# EAGLE design FrontPanel_v2 (EAGLE 9.7.0)
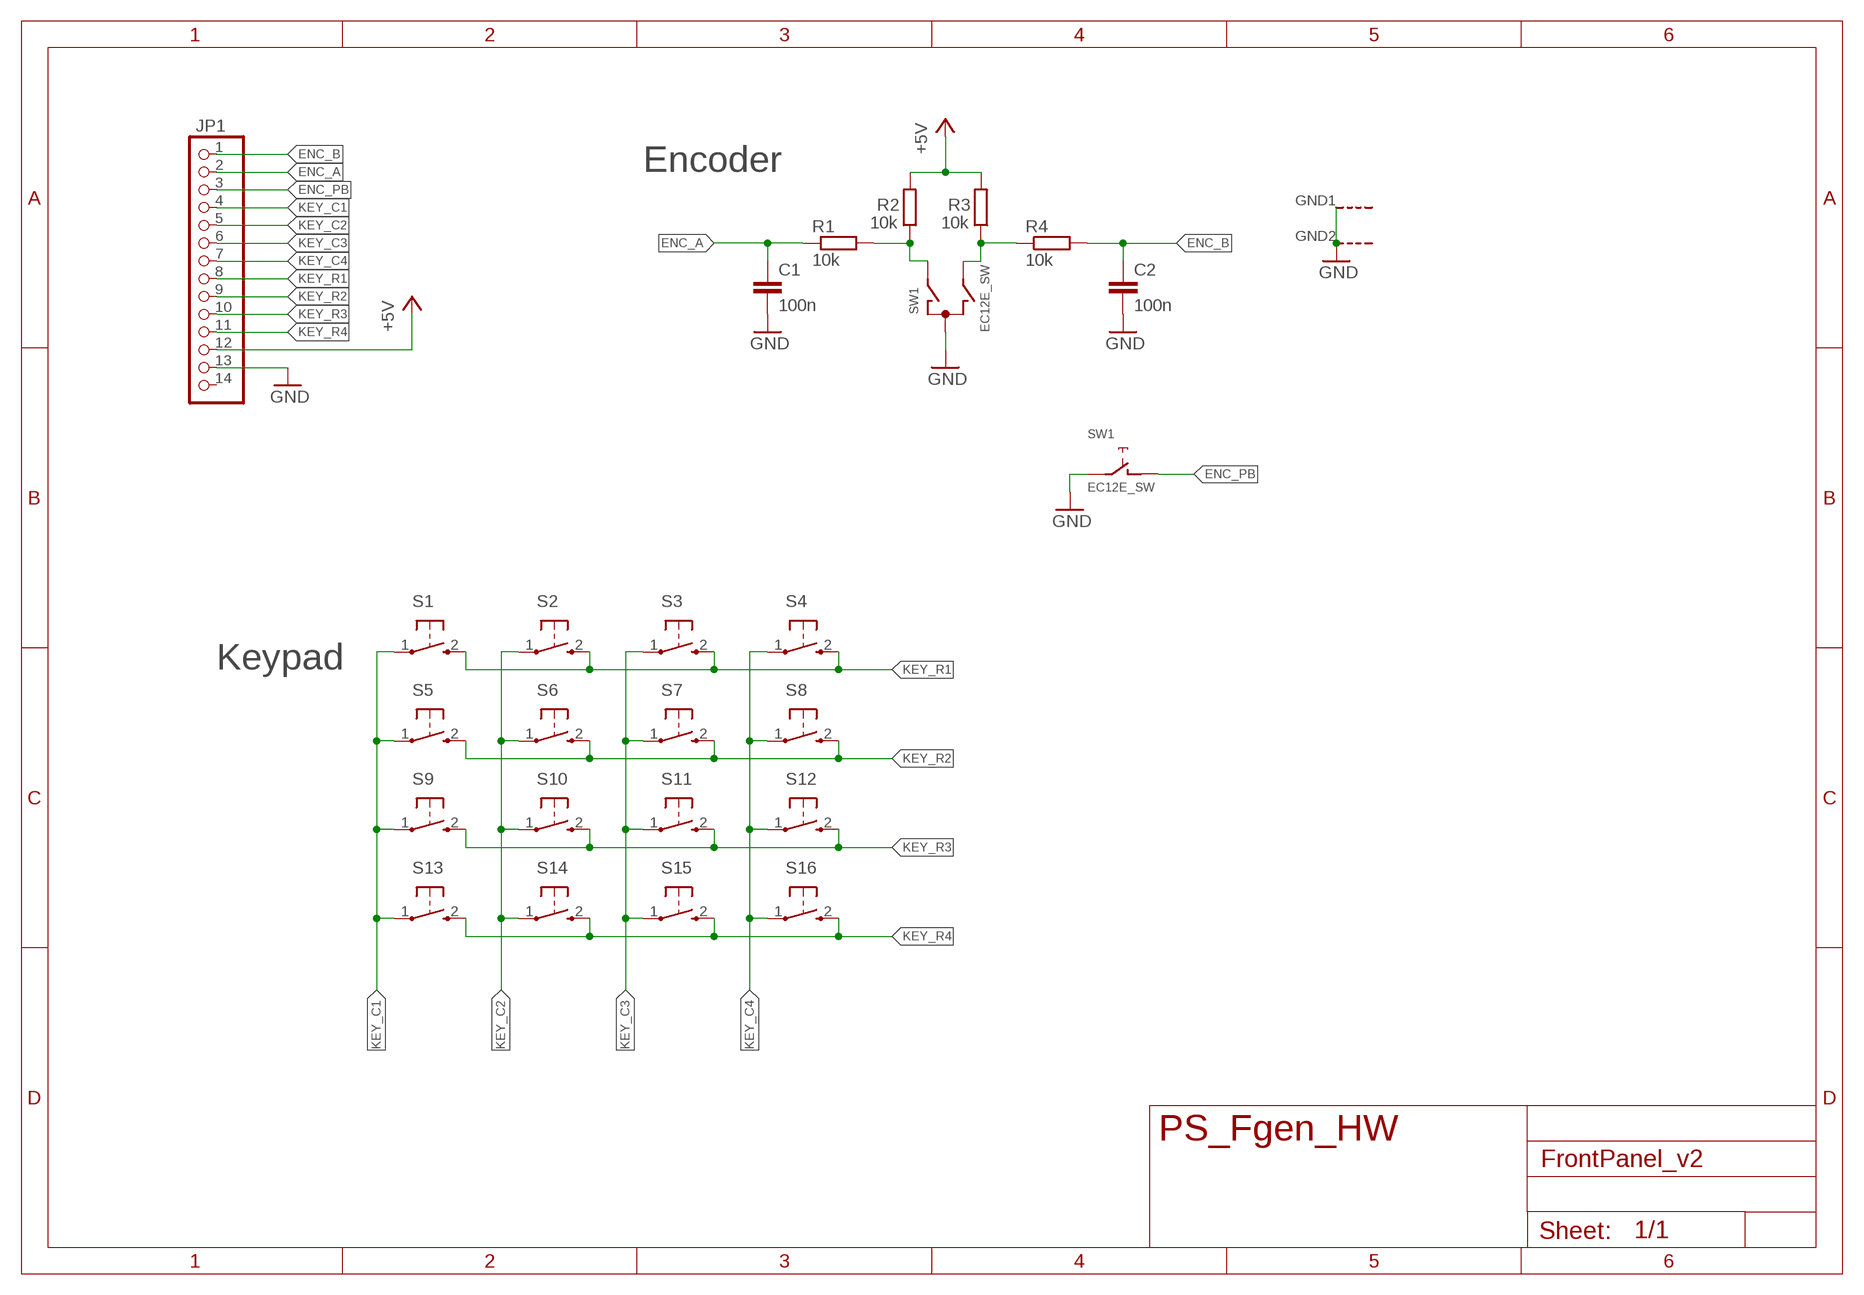
[diagram p0: schematic, sheet 1]

## Parts
C1  100n  C-EUC0805  [C0805]
C2  100n  C-EUC0805  [C0805]
JP1  PINHD-1X14  [1X14]
R1  10k  R-EU_R0805  [R0805]
R2  10k  R-EU_R0805  [R0805]
R3  10k  R-EU_R0805  [R0805]
R4  10k  R-EU_R0805  [R0805]
S1  KURZHUBTASTER  [B3F-10XX]
S2  KURZHUBTASTER  [B3F-10XX]
S3  KURZHUBTASTER  [B3F-10XX]
S4  KURZHUBTASTER  [B3F-10XX]
S5  KURZHUBTASTER  [B3F-10XX]
S6  KURZHUBTASTER  [B3F-10XX]
S7  KURZHUBTASTER  [B3F-10XX]
S8  KURZHUBTASTER  [B3F-10XX]
S9  KURZHUBTASTER  [B3F-10XX]
S10  KURZHUBTASTER  [B3F-10XX]
S11  KURZHUBTASTER  [B3F-10XX]
S12  KURZHUBTASTER  [B3F-10XX]
S13  KURZHUBTASTER  [B3F-10XX]
S14  KURZHUBTASTER  [B3F-10XX]
S15  KURZHUBTASTER  [B3F-10XX]
S16  KURZHUBTASTER  [B3F-10XX]
SW1  EC12E_SW  [ALPS_EC12E_SW]

## Nets
+5V: JP1.12 R2.2 R3.2
ENC_A: C1.1 JP1.2 R1.1
ENC_B: C2.1 JP1.1 R4.2
ENC_PB: JP1.3 SW1.D
GND: C1.2 C2.2 JP1.13 SW1.C SW1.E SW1.GND1(G) SW1.GND2(G)
KEY_C1: JP1.4 S1.1(P) S5.1(P) S9.1(P) S13.1(P)
KEY_C2: JP1.5 S2.1(P) S6.1(P) S10.1(P) S14.1(P)
KEY_C3: JP1.6 S3.1(P) S7.1(P) S11.1(P) S15.1(P)
KEY_C4: JP1.7 S4.1(P) S8.1(P) S12.1(P) S16.1(P)
KEY_R1: JP1.8 S1.2(S) S2.2(S) S3.2(S) S4.2(S)
KEY_R2: JP1.9 S5.2(S) S6.2(S) S7.2(S) S8.2(S)
KEY_R3: JP1.10 S9.2(S) S10.2(S) S11.2(S) S12.2(S)
KEY_R4: JP1.11 S13.2(S) S14.2(S) S15.2(S) S16.2(S)
N$1: R1.2 R2.1 SW1.A
N$2: R3.1 R4.1 SW1.B
Unconnected: JP1.14

## Notes on the sheet
- Encoder
- Keypad
- PS_Fgen_HW

## Library data of the parts
C1 C2 = rcl:C-EU: CAPACITOR, European symbol; SPICEPREFIX: C
JP1 = pinhead:PINHD-1X14: PIN HEADER
R1-R4 = rcl:R-EU_: RESISTOR, European symbol; SPICEPREFIX: R
S1-S16 = OwnDevices:KURZHUBTASTER: OMRON SWITCH
SW1 = switch-alps:EC12E_SW: ALPS rotary Encoder EC12E series with switch; MPN: EC12E2424407; OC_FARNELL: 1520813; OC_NEWARK: 74M1068

## Board
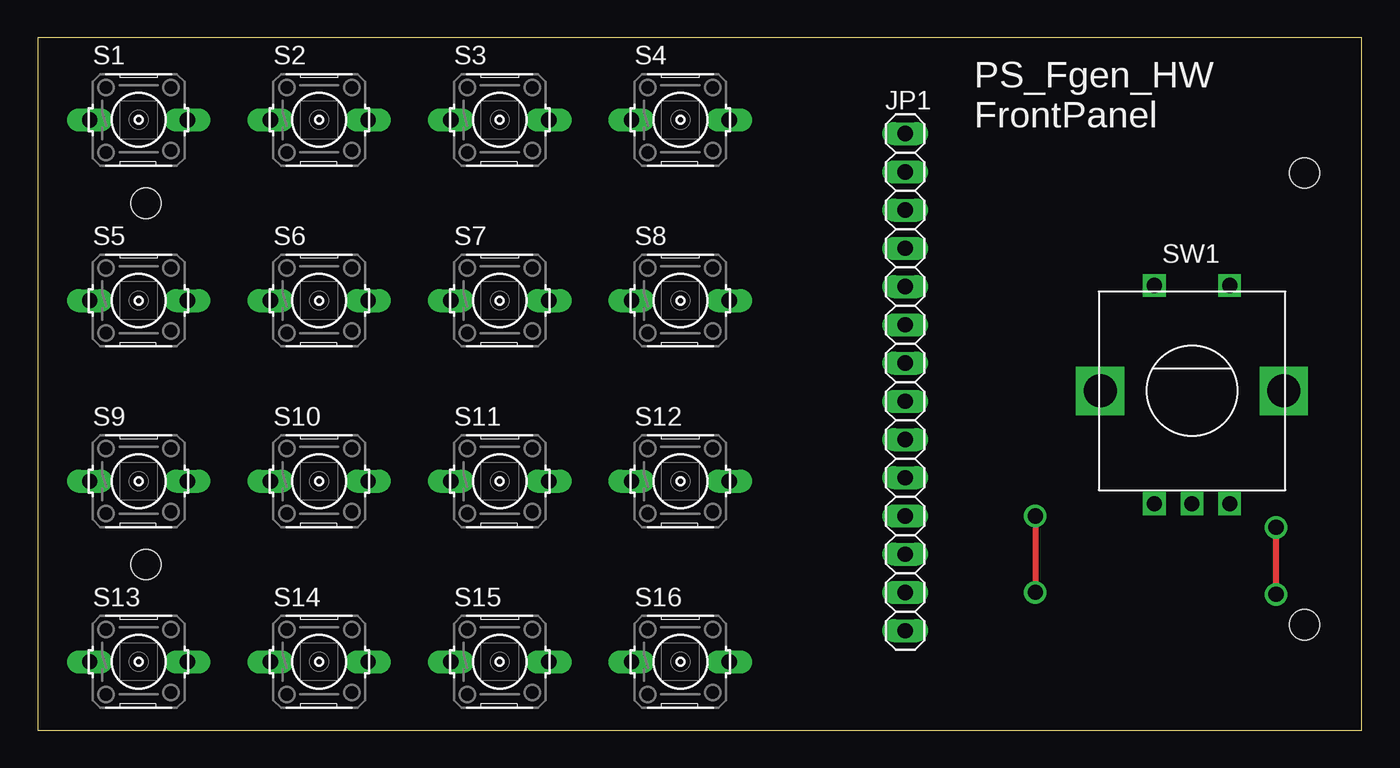
[diagram p1: board, top side]
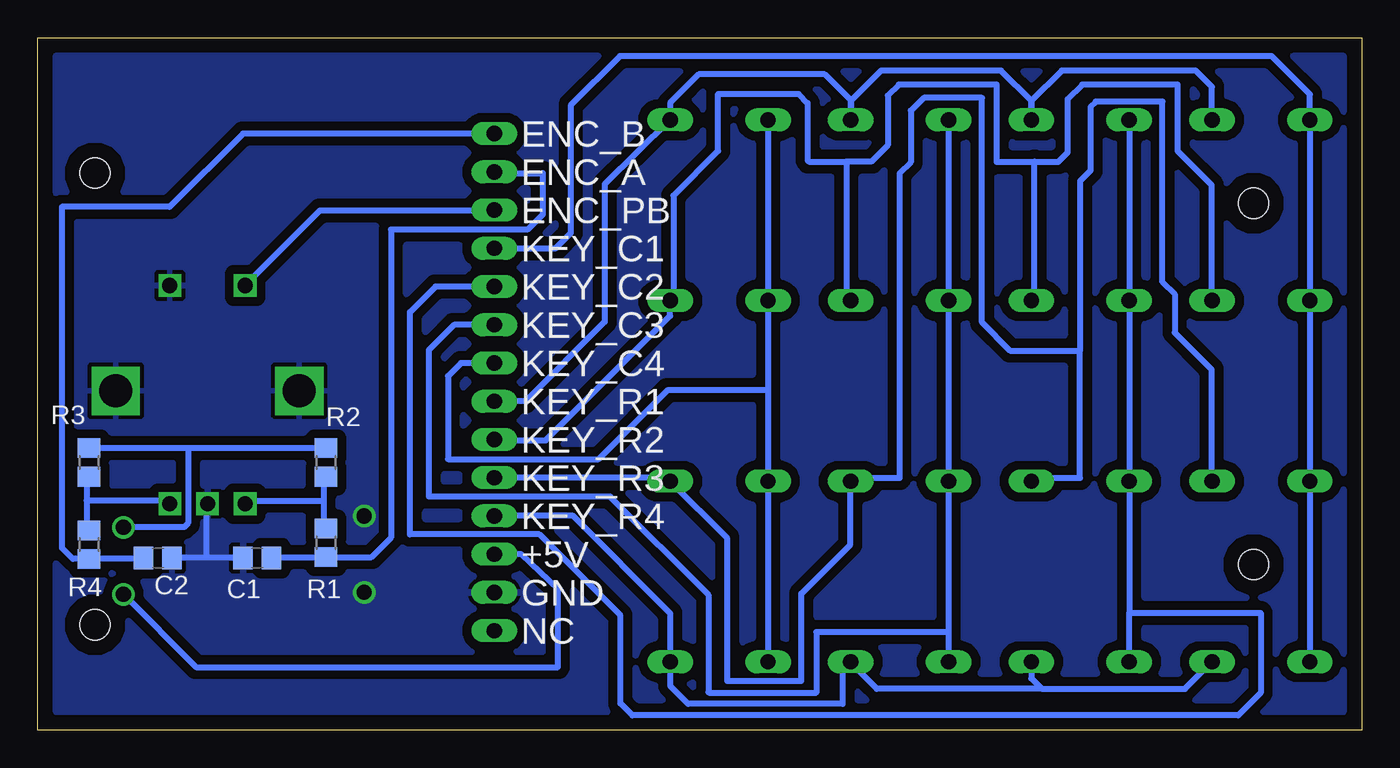
[diagram p2: board, bottom side, seen from below]

Size 88 x 46 mm. Coordinates in mm from the lower left corner, seen from the top.
Outline: 0,0 88,0 88,46 0,46 0,0
Copper layers (1*16): Top / Bottom
Stack-up Default Layer Stack: Top User Defined 0.035mm / Dielectric-1 User Defined 1.5mm / Bottom User Defined 0.035mm
Design rules: minimum copper width 6mil, minimum drill size 0.35mm, copper clearance wire_polygon to wire_polygon 6mil, copper clearance wire_polygon to pad_smd 6mil, copper clearance wire_polygon to via 6mil, copper clearance pad_smd to pad_smd 6mil, copper clearance pad_smd to via 6mil, copper clearance via to via 6mil, copper clearance smd to pad (same net) 6mil, copper clearance smd to via (same net) 6mil, copper clearance smd to smd (same net) 6mil, dimension clearance 40mil, via restrict clearance 0mil, restrict clearance 0mil, drill distance 6mil, keepout clearance 0mil
Holes 2 mm at 7.19,11 7.19,35 84.19,37 84.19,7

### Footprints (pad centres in the part's own frame; a part is rotated, then mirrored left to right if it is on the bottom)
C0805 = smd 1.3 x 1.5: 1 -0.95,0; 2 0.95,0
1X14 = drill 1.016 long: 1 -16.51,0; 2 -13.97,0; 3 -11.43,0; 4 -8.89,0; 5 -6.35,0; 6 -3.81,0; 7 -1.27,0; 8 1.27,0; 9 3.81,0; 10 6.35,0; 11 8.89,0; 12 11.43,0; 13 13.97,0; 14 16.51,0
R0805 = smd 1.3 x 1.5: 1 -0.95,0; 2 0.95,0
B3F-10XX = drill 1.016 long: 1 -3.251,0; 2 3.251,0
ALPS_EC12E_SW = drill 1 square: A -2.5,-7.5; B 2.5,-7.5; C 0,-7.5; D -2.5,7; E 2.5,7 | drill 2.2 square: GND1 -6.1,0; GND2 6.1,0

### Placement (x,y rotation side)
C1  73.41,11.43 180 bottom
C2  80.01,11.43 0 bottom
JP1  57.66,23.11 270 top
R1  68.83,12.45 90 bottom
R2  68.83,17.78 90 bottom
R3  84.58,17.78 90 bottom
R4  84.58,12.32 270 bottom
S1  6.71,40.54 0 top
S2  18.71,40.54 0 top
S3  30.71,40.54 0 top
S4  42.71,40.54 0 top
S5  6.71,28.54 0 top
S6  18.71,28.54 0 top
S7  30.71,28.54 0 top
S8  42.71,28.54 0 top
S9  6.71,16.54 0 top
S10  18.71,16.54 0 top
S11  30.71,16.54 0 top
S12  42.71,16.54 0 top
S13  6.71,4.54 0 top
S14  18.71,4.54 0 top
S15  30.71,4.54 0 top
S16  42.71,4.54 0 top
SW1  76.71,22.54 0 top

### Tracks (layer width: path | path; a pad name or v marks a point on that pad's centre or on a via)
+5V  (via drill 1 pad 1.5)
  Top 0.406: v82.3,13.46 v82.3,9.02
  Bottom 0.152: 69,18.75 R2.2 | 84.5,18.75 R3.2
  Bottom 0.406: 84.5,18.75 78,18.75 | 78,18.75 69,18.75 | v82.3,9.02 77.47,4.19 53.43,4.19 53.43,9.36 55.88,11.68 JP1.12 | 78,18.75 78,13.74 78.25,13.49 82.27,13.49 v82.3,13.46
ENC_A
  Bottom 0.152: 57.46,37 JP1.2
  Bottom 0.406: C1.1 72.25,11.49 R1.1 65.82,11.5 64.52,12.79 64.52,33.25 55.45,33.25 54.44,34.25 54.44,37 57.46,37
ENC_B
  Bottom 0.406: C2.1 84.52,11.43 R4.2 85.65,11.37 86.39,12.1 86.39,34.75 79.23,34.75 74.35,39.62 JP1.1
ENC_PB
  Bottom 0.152: 74,29.75 SW1.D | 57.71,34.5 JP1.3
  Bottom 0.406: 74,29.75 69.25,34.5 57.71,34.5
GND  (via drill 1 pad 1.5)
  Top 0.406: v66.29,14.22 v66.29,9.14
  Bottom 0.152: 76.75,15 SW1.C
  Bottom 0.406: 76.75,11.49 79,11.49 C2.2 | 76.75,11.49 74.5,11.49 C1.2 | 76.75,11.49 76.75,15 | v66.29,14.22 66.23,14.29
  pour Bottom (isolate 0.61): 88.47,46.56 -0.2,46.56 -0.2,-0.2 88.47,-0.2
KEY_C1
  Bottom 0.406: S13.1 S9.1 S5.1 S1.1 3.46,42.23 6,44.77 49.31,44.77 52.58,41.51 52.58,33.02 53.59,32 JP1.4
KEY_C2
  Bottom 0.406: S2.1 S6.1 S10.1 15.46,7.78 | JP1.5 61.56,29.46 63.26,27.77 63.26,13 54.66,13 49.28,7.62 49.28,1.78 48.48,0.98 8.22,0.98 6.73,2.47 6.73,7.78 15.46,7.78 | S14.1 15.46,7.78
KEY_C3
  Bottom 0.406: S3.1 S7.1 S11.1 27.46,6.51 | 27.46,6.51 S15.1 | JP1.6 60.33,26.92 62,25.26 62,15.5 49.95,15.5 43.43,8.99 43.43,2.54 43.39,2.49 36.26,2.49 36.26,6.51 27.46,6.51
KEY_C4
  Bottom 0.406: S4.1 S8.1 39.46,22.61 | 39.46,22.61 S12.1 S16.1 | JP1.7 59.87,24.38 60.73,23.52 60.73,18 50.71,18 46.1,22.61 39.46,22.61
KEY_R1
  Bottom 0.406: S1.2 9.96,42.73 11.05,43.81 19.94,43.81 21.96,41.79 S2.2 21.96,41.81 23.97,43.81 31.95,43.81 33.96,41.81 S3.2 33.96,41.84 35.69,43.56 44.07,43.56 45.96,41.67 S4.2 50.32,36.28 50.32,27.11 55.59,21.84 JP1.8
KEY_R2
  Bottom 0.152: JP1.9 57.6,19.25 | 21.79,37.72 21.75,37.76 | 10,28.75 S5.2 | 21.75,28.75 S6.2
  Bottom 0.406: 57.6,19.25 54.24,19.25 45.96,27.52 S8.2 45.75,28.75 45.75,35.5 42.77,38.48 42.77,42.26 37.43,42.26 36.83,41.66 36.83,37.85 36.75,37.76 34.26,37.76 | 10,28.75 10,36.22 12.24,38.46 12.24,42.88 18.58,42.88 19.56,41.91 19.56,38.35 20.19,37.72 21.79,37.72 24.26,37.72 24.26,42.88 30.77,42.88 31.5,42.16 31.5,38.86 32.6,37.76 34.26,37.76 | 21.75,28.75 21.75,37.76 | S7.2 34.26,28.83 34.26,37.76
KEY_R3
  Bottom 0.152: 10,16.75 S9.2 | 21.75,16.75 S10.2 | 34,16.5 S11.2 33.75,16.75 | 57.46,16.75 JP1.10
  Bottom 0.406: 10,16.75 10,23.96 12.45,26.41 12.45,28.96 13.25,29.76 13.25,41.75 17.69,41.75 18.03,41.4 18.03,37.17 18.73,36.47 18.73,25.21 | 18.73,25.21 18.73,16.75 21.75,16.75 | 34,16.5 34,12.32 37.25,9.07 37.25,3.25 42.16,3.25 42.16,12.74 S12.2 46,16.75 57.46,16.75 | 18.73,25.21 23.38,25.21 25.25,27.08 25.25,42 29.12,42 29.97,41.15 29.97,37.74 30.73,36.98 30.73,16.75 33.75,16.75
KEY_R4
  Bottom 0.152: 10,4.5 S13.2 | S15.2 33.96,4.46 | JP1.11 57.62,14.27
  Bottom 0.406: 10,4.5 11.76,2.74 21.26,2.74 | S14.2 21.96,3.44 21.26,2.74 | 33.96,4.46 32.24,2.74 21.26,2.74 | S15.2 34.51,4 34.51,1.74 44.77,1.74 45.96,2.94 S16.2 45.96,7.76 52.47,14.27 57.62,14.27
N$1
  Bottom 0.152: 69,13.49 R1.2 | 69,16.75 R2.1
  Bottom 0.406: 69,16.75 69,15.25 | 69,15.25 69,13.49 | 69,15.25 74,15.25 SW1.A
N$2
  Bottom 0.152: 84.75,13.36 R4.1 | 84.75,16.75 R3.1 | 79.25,15.25 SW1.B
  Bottom 0.406: 84.75,16.75 84.75,15.25 | 84.75,15.25 84.75,13.36 | 79.25,15.25 84.75,15.25

### Text on the board
tPlace: PS_Fgen_HW / FrontPanel
bPlace: ENC_B | ENC_A | ENC_PB | KEY_C1 | KEY_C2 | KEY_C3 | KEY_C4 | KEY_R1 | KEY_R2 | KEY_R3 | KEY_R4 | +5V | GND | NC